# Altium schematic sheet 4x4.SchDoc
size A4
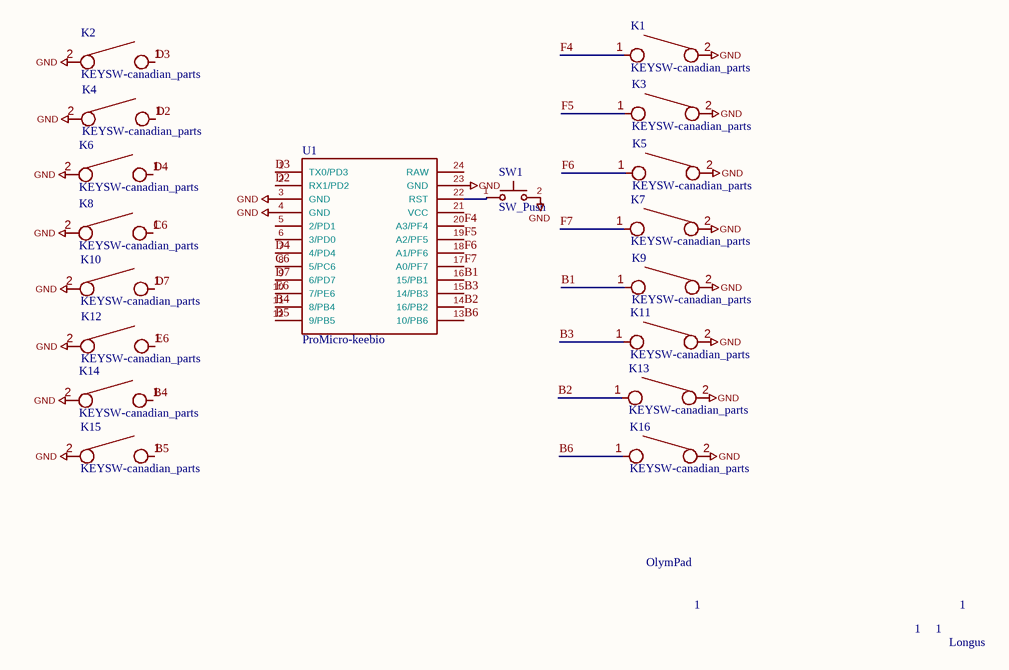
[diagram p0: 4x4.SchDoc]

## Parts
K1  KEYSW-canadian_parts  [Socket]
K2  KEYSW-canadian_parts  [Socket]
K3  KEYSW-canadian_parts  [Socket]
K4  KEYSW-canadian_parts  [Socket]
K5  KEYSW-canadian_parts  [Socket]
K6  KEYSW-canadian_parts  [Socket]
K7  KEYSW-canadian_parts  [Socket]
K8  KEYSW-canadian_parts  [Socket]
K9  KEYSW-canadian_parts  [Socket]
K10  KEYSW-canadian_parts  [Socket]
K11  KEYSW-canadian_parts  [Socket]
K12  KEYSW-canadian_parts  [Socket]
K13  KEYSW-canadian_parts  [Socket]
K14  KEYSW-canadian_parts  [Socket]
K15  KEYSW-canadian_parts  [Socket]
K16  KEYSW-canadian_parts  [Socket]
SW1  SW_Push  [Reset]
U1  ProMicro-keebio  [Pro-Micro]

## Nets
GND: K1.2 K2.2 K3.2 K4.2 K5.2 K6.2 K7.2 K8.2 K9.2 K10.2 K11.2 K12.2 K13.2 K14.2 K15.2 K16.2 SW1.2 U1.3(GND) U1.4(GND) U1.23(GND)
B1: K9.1 U1.16(15/PB1)
B2: K13.1 U1.14(16/PB2)
B3: K11.1 U1.15(14/PB3)
B4: K14.1 U1.11(8/PB4)
B5: K15.1 U1.12(9/PB5)
B6: K16.1 U1.13(10/PB6)
C6: K8.1 U1.8(5/PC6)
D2: K4.1 U1.2(RX1/PD2)
D3: K2.1 U1.1(TX0/PD3)
D4: K6.1 U1.7(4/PD4)
D7: K10.1 U1.9(6/PD7)
E6: K12.1 U1.10(7/PE6)
F4: K1.1 U1.20(A3/PF4)
F5: K3.1 U1.19(A2/PF5)
F6: K5.1 U1.18(A1/PF6)
F7: K7.1 U1.17(A0/PF7)
NetSW1_1: SW1.1 U1.22(RST)

Not connected (* = marked no-connect by the designer): U1 5(2/PD1) 6(3/PD0) 21(VCC) 24(RAW)

## Notes on the sheet
- OlymPad
- 1
- 1     1
- Longus